# Altium schematic sheet INA128仪放.SchDoc
size A4
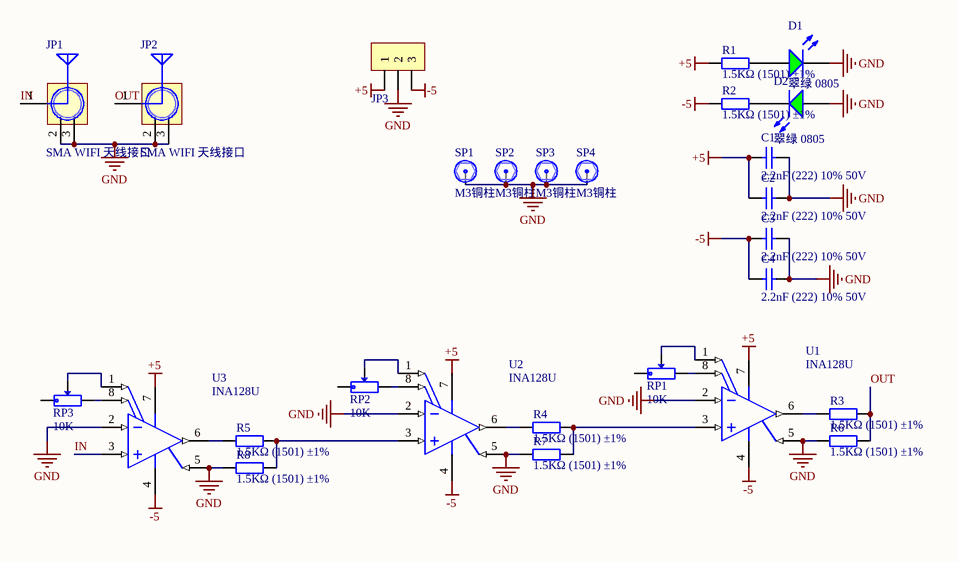
[diagram p0: INA128仪放.SchDoc]

## Parts
C1  2.2nF (222) 10% 50V  [0603_C]
C2  2.2nF (222) 10% 50V  [0603_C]
C3  2.2nF (222) 10% 50V  [0603_C]
C4  2.2nF (222) 10% 50V  [0603_C]
D1  翠绿 0805  [0805_LED_S1]
D2  翠绿 0805  [0805_LED_S1]
JP1  SMA WIFI 天线接口  [SMA-KE]
JP2  SMA WIFI 天线接口  [SMA-KE]
JP3  HDR-1X3  [XH2.54-WS-3P]  (value not drawn)
R1  1.5KΩ (1501) ±1%  [0805_R]
R2  1.5KΩ (1501) ±1%  [0805_R]
R3  1.5KΩ (1501) ±1%  [0805_R]
R4  1.5KΩ (1501) ±1%  [0805_R]
R5  1.5KΩ (1501) ±1%  [0805_R]
R6  1.5KΩ (1501) ±1%  [0805_R]
R7  1.5KΩ (1501) ±1%  [0805_R]
R8  1.5KΩ (1501) ±1%  [0805_R]
RP1  10K  [RM065]
RP2  10K  [RM065]
RP3  10K  [RM065]
SP1  M3铜柱  [M3x4_L]
SP2  M3铜柱  [M3x4_L]
SP3  M3铜柱  [M3x4_L]
SP4  M3铜柱  [M3x4_L]
U1  INA128U  [SOP8_N]
U2  INA128U  [SOP8_N]
U3  INA128U  [SOP8_N]

## Nets
+5: C1.1 C2.1 JP3.1 R1.1 U1.7(V+) U2.7(V+) U3.7(V+)
-5: C3.1 C4.1 JP3.3 R2.1 U1.4(V-) U2.4(V-) U3.4(V-)
GND: C1.2 C2.2 C3.2 C4.2 D1.K D2.A JP1.2(GND) JP1.3(GND) JP2.2(GND) JP2.3(GND) JP3.2 R6.1 R7.1 R8.1 SP1.1 SP2.1 SP3.1 SP4.1 U1.2(VIN-) U1.5(REF) U2.2(VIN-) U2.5(REF) U3.2(VIN-) U3.5(REF)
IN: JP1.1(ANT) U3.3(VIN+)
OUT: JP2.1(ANT) R3.2 R6.2
NetD1_A: D1.A R1.2
NetD2_K: D2.K R2.2
NetR3_1: R3.1 U1.6(VO)
NetR4_1: R4.1 U2.6(VO)
NetR4_2: R4.2 R7.2 U1.3(VIN+)
NetR5_1: R5.1 U3.6(VO)
NetR5_2: R5.2 R8.2 U2.3(VIN+)
NetRP1_2: RP1.2 U1.1(RG)
NetRP1_3: RP1.3 U1.8(RG)
NetRP2_2: RP2.2 U2.1(RG)
NetRP2_3: RP2.3 U2.8(RG)
NetRP3_2: RP3.2 U3.1(RG)
NetRP3_3: RP3.3 U3.8(RG)

Not connected (* = marked no-connect by the designer): RP1 1; RP2 1; RP3 1

## Library data of the parts
C1-C4 = 0603 2.2nF (222) 10% 50V: 贴片电容; ComponentLink1Description: 供应商链接; ComponentLink1URL: http://www.szlcsc.com/product/details_1956.html; Package: 0603; Supplier: LC; SuppliersPartNumber: C1604
D1 D2 = 0805 翠绿: 发光二极管; ComponentLink1Description: 供应商链接; ComponentLink1URL: http://www.szlcsc.com/product/details_2670.html; Package: 0805; Supplier: LC; SuppliersPartNumber: C2297
JP1 JP2 = SMA: SMA-2.4G射频天线接口; BOM名称: SMA-2.4G射频天线接口
JP3 = Header 3: 3P接插件; BOM名称: 3P接插件
R1-R8 = 0805 1.5KΩ (1501) 1%: 贴片电阻; ComponentLink1Description: 供应商链接; ComponentLink1URL: http://www.szlcsc.com/product/details_4717.html; Package: 0805; Supplier: LC; SuppliersPartNumber: C4310
RP1-RP3 = RP-ID: 插件单联电位器; BOM名称: 插件电位器
SP1-SP4 = 铜柱小焊盘: 铜柱; BOM名称: 铜柱
U1-U3 = CMP-0992-00017-2: Precision, Low Power Instrumentation Amplifier, -40 to 85 degC, 8-pin SOIC (D8), Green (RoHS & no Sb/Br); Manufacturer: Texas Instruments; Gain(V/V): 1 to 10000; Noise at 1kHz(Typ)(nV/rt(Hz)): 8; Number of Channels: 1; Vs(Max)(V): 36; Vs(Min)(V): 4.5; Input Offset (+/-)(Max)(uV): 50; Input Bias Current (+/-)(Max)(nA): 5; Non-Linearity (+/-)(Max)(%): 0.002; CMRR(Min)(dB): 120; Input Offset Drift (+/-)(Max)(uV/Degrees Celsius): 0.5; SubFamily: Dual Supply; Quiescent Current (+/-)(Typ)(mA): 0.7; ComponentLink1URL: http://www.ti.com/; PackageVersion: 4040047-3/M, 06/2011; PackageDescription: 8-Pin Plastic Small Outline, Body 4.9 x 3.9 mm, Pitch 1.27 mm; Mounting Technology: Surface Mount; ComponentLink3URL: http://www.ti.com/litv/pdf/msoi002j; ComponentLink3Description: Package Specification; PackageReference: D0008A; PartNumber: INA128U; Code_JEDEC: MS-012; ComponentLink2Description: Datasheet; Eco-Plan: Green (RoHS & no Sb/Br); DatasheetVersion: SBOS051B; ComponentLink2URL: http://www.ti.com/general/docs/lit/getliterature.tsp?genericPartNumber=INA128&fileType=pdf; ComponentLink1Description: Manufacturer URL; Manufacturer Part Number: INA128U